# EAGLE design LK-1 (EAGLE 9.5.2)

## Sheet 1 of 2
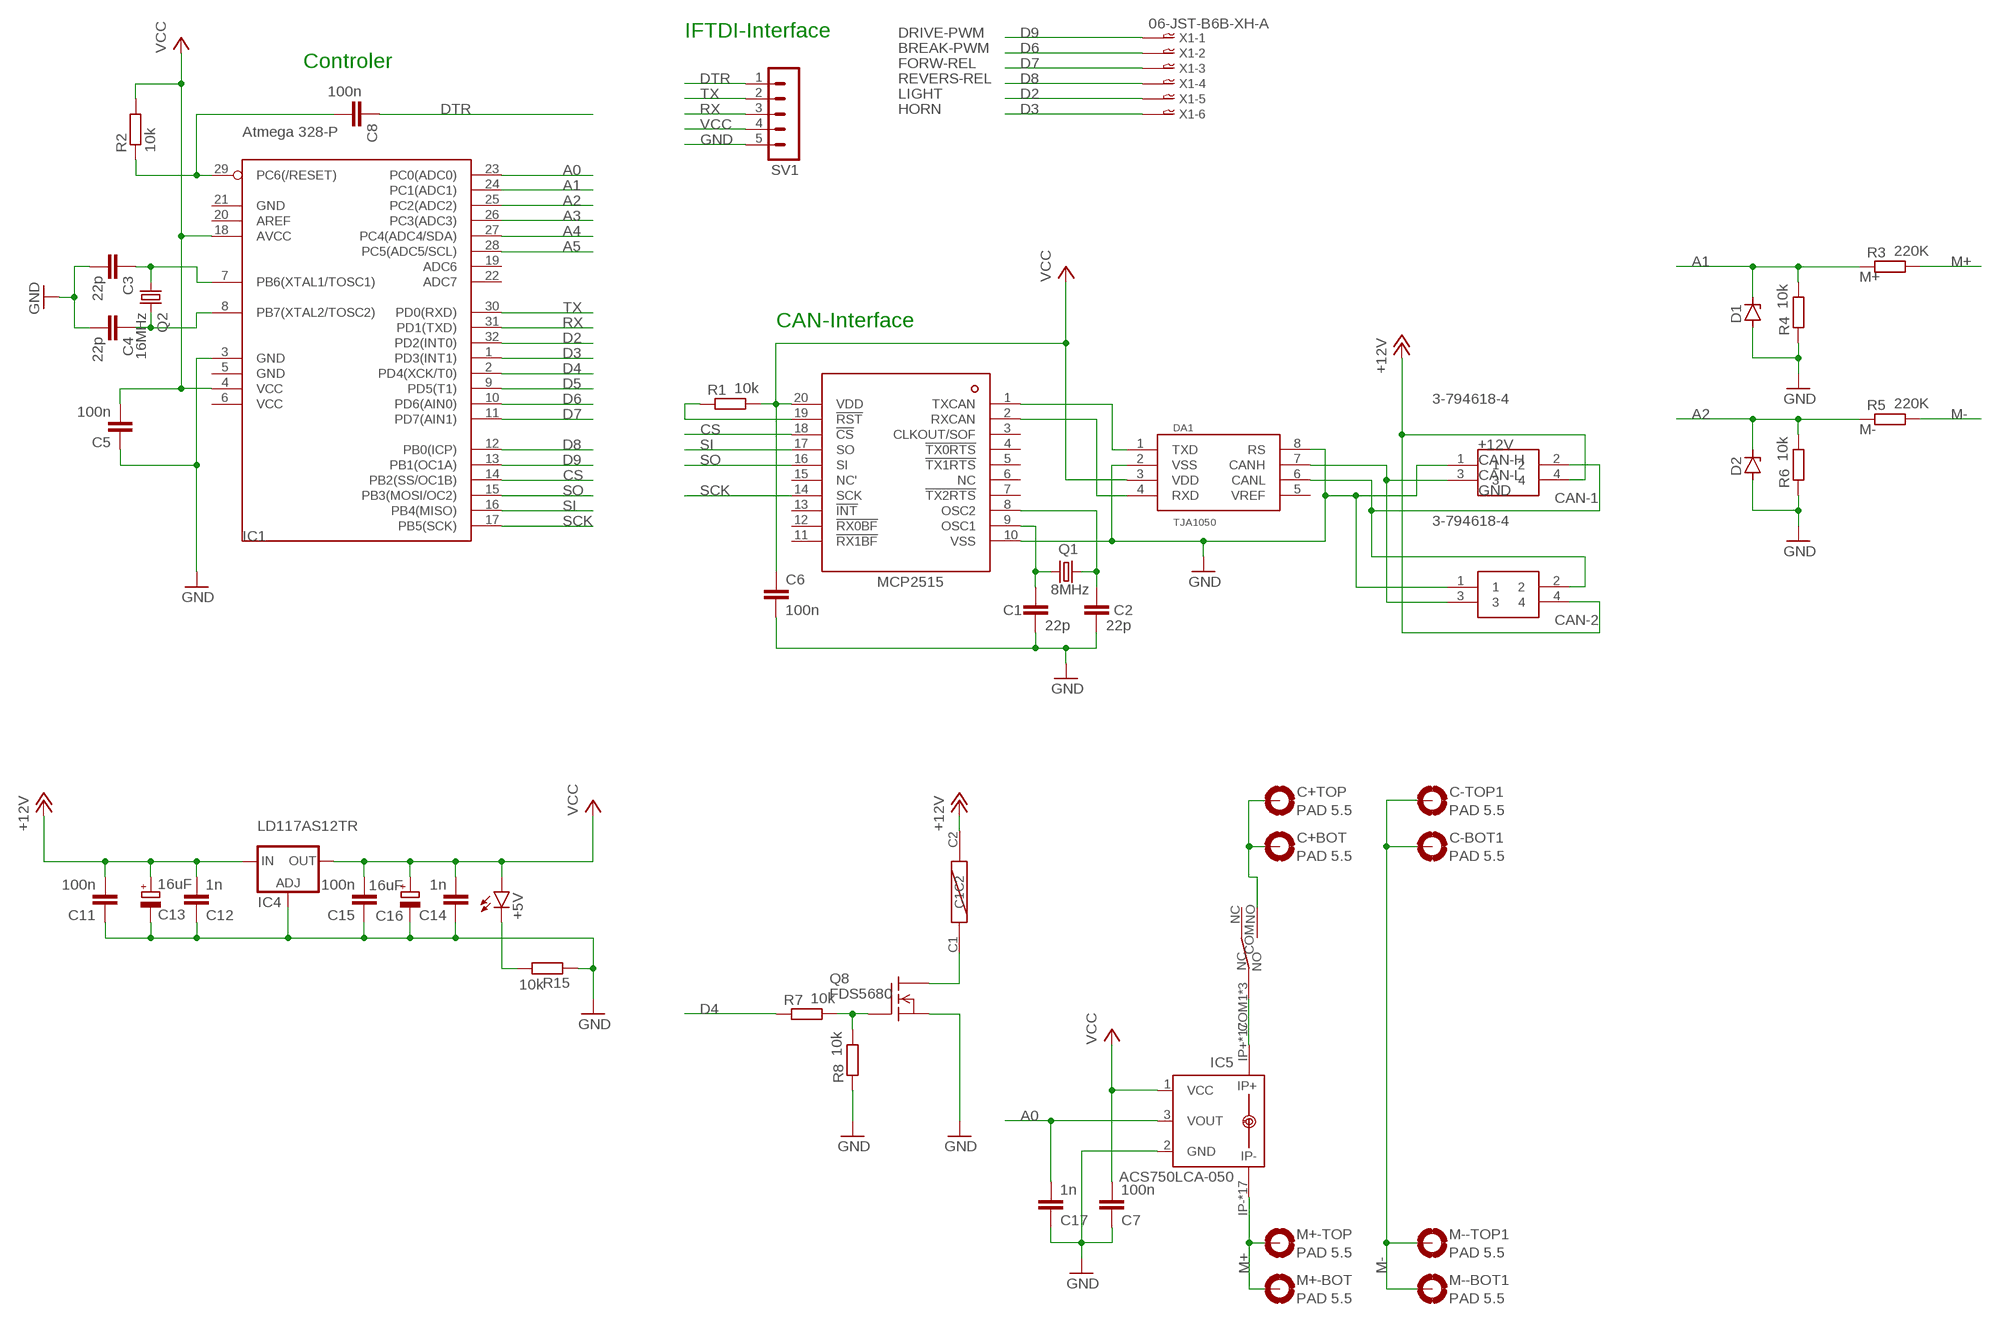
[diagram p0: schematic, sheet 1]

### Parts
+5V  LEDCHIP-LED0603  [CHIP-LED0603]
C1  22p  C-EUC0402K  [C0402K]
C2  22p  C-EUC0402K  [C0402K]
C3  22p  C-EUC0402K  [C0402K]
C4  22p  C-EUC0402K  [C0402K]
C5  100n  C-EUC0402K  [C0402K]
C6  100n  C-EUC0402K  [C0402K]
C7  100n  C-EUC0402K  [C0402K]
C8  100n  C-EUC0402K  [C0402K]
C11  100n  C-EUC0402K  [C0402K]
C12  1n  C-EUC0402K  [C0402K]
C13  16uF  CPOL-EUA/3216-18W  [A/3216-18W]
C14  1n  C-EUC0402K  [C0402K]
C15  100n  C-EUC0402K  [C0402K]
C16  16uF  CPOL-EUA/3216-18W  [A/3216-18W]
C17  1n  C-EUC0402K  [C0402K]
C+BOT  PAD 5.5  MOUNT-PAD-ROUND5.5  [5,5-PAD]
C+TOP  PAD 5.5  MOUNT-PAD-ROUND5.5  [5,5-PAD]
C-BOT1  PAD 5.5  MOUNT-PAD-ROUND5.5  [5,5-PAD]
C-TOP1  PAD 5.5  MOUNT-PAD-ROUND5.5  [5,5-PAD]
CAN-1  3-794618-4  [SHDRRA4W102P300_2X2_686X892X73]
CAN-2  3-794618-4  [SHDRRA4W102P300_2X2_686X892X73]
D1  ZENER-DIODESOD80C  [SOD80C]
D2  ZENER-DIODESOD80C  [SOD80C]
DA1  TJA1050  [SO08]
IC1  Atmega 328-P  MEGA8-AI  [TQFP32-08]
IC2  MCP2515  [TSSOP20]
IC4  LD117AS12TR  [SOT223]
IC5  ACS750LCA-050  [ACS75050]
M+-BOT  PAD 5.5  MOUNT-PAD-ROUND5.5  [5,5-PAD]
M+-TOP  PAD 5.5  MOUNT-PAD-ROUND5.5  [5,5-PAD]
M--BOT1  PAD 5.5  MOUNT-PAD-ROUND5.5  [5,5-PAD]
M--TOP1  PAD 5.5  MOUNT-PAD-ROUND5.5  [5,5-PAD]
Q1  8MHz  CRYSTALHC49S  [HC49/S]
Q2  16MHz  CRYSTALHC49S  [HC49/S]
Q8  FDS5680  [SO-8]
R1  10k  R-EU_R0805  [R0805]
R2  10k  R-EU_R0805  [R0805]
R3  220K  R-EU_R0805  [R0805]
R4  10k  R-EU_R0805  [R0805]
R5  220K  R-EU_R0805  [R0805]
R6  10k  R-EU_R0805  [R0805]
R7  10k  R-EU_R0805  [R0805]
R8  10k  R-EU_R0805  [R0805]
R15  10k  R-EU_R0805  [R0805]
SV1  MA05-1  [MA05-1]
U$1  FRA2C-2  [FRA2C-2]
X1  06-JST-B6B-XH-A  [B6B-XH]

### Nets
+12V: C11.2 C12.2 C13.+ CAN-1.4 CAN-2.4 IC4.3(IN) U$1.C2
A0: C17.2 IC1.23(PC0(ADC0)) IC5.3(VOUT)
A1: D1.C IC1.24(PC1(ADC1)) R3.1 R4.2
A2: D2.C IC1.25(PC2(ADC2)) R5.1 R6.2
A3: IC1.26(PC3(ADC3))
A4: IC1.27(PC4(ADC4/SDA))
A5: IC1.28(PC5(ADC5/SCL))
C-: C+BOT.B5,5(MOUNT) C+TOP.B5,5(MOUNT) U$1.NO
C-1: IC5.IP+ IC5.IP+@2(IP+) IC5.IP+@3(IP+) IC5.IP+@4(IP+) IC5.IP+@5(IP+) IC5.IP+@6(IP+) IC5.IP+@7(IP+) IC5.IP+@8(IP+) IC5.IP+@9(IP+) IC5.IP+@10(IP+) IC5.IP+@11(IP+) IC5.IP+@12(IP+) IC5.IP+@13(IP+) IC5.IP+@14(IP+) IC5.IP+@15(IP+) IC5.IP+@16(IP+) IC5.IP+@17(IP+) U$1.COM1(COM) U$1.COM2(COM) U$1.COM3(COM)
CAN-H: CAN-1.3 CAN-2.3 DA1.7(CANH)
CAN-L: CAN-1.2 CAN-2.2 DA1.6(CANL)
CAN-OCC1: C1.1 IC2.9(OSC1) Q1.1
CAN-OCC2: C2.1 IC2.8(OSC2) Q1.2
CS: IC1.14(PB2(SS/OC1B)) IC2.18(!CS)
D2: IC1.32(PD2(INT0)) X1.P$5
D3: IC1.1(PD3(INT1)) X1.P$6
D4: IC1.2(PD4(XCK/T0)) R7.1
D5: IC1.9(PD5(T1))
D6: IC1.10(PD6(AIN0)) X1.P$2
D7: IC1.11(PD7(AIN1)) X1.P$3
D8: IC1.12(PB0(ICP)) X1.P$4
D9: IC1.13(PB1(OC1A)) X1.P$1
DTR: C8.1 SV1.1
GND: C1.2 C2.2 C3.2 C4.2 C5.1 C6.2 C7.1 C11.1 C12.1 C13.- C14.1 C15.1 C16.- C17.1 CAN-1.1 CAN-2.1 D1.A D2.A DA1.2(VSS) DA1.8(RS) IC1.3(GND) IC2.10(VSS) IC4.1(ADJ) IC5.2(GND) Q8.1(S) Q8.2(S) Q8.3(S) R4.1 R6.1 R8.1 R15.1 SV1.5
M+: IC5.IP- IC5.IP-@2(IP-) IC5.IP-@3(IP-) IC5.IP-@4(IP-) IC5.IP-@5(IP-) IC5.IP-@6(IP-) IC5.IP-@7(IP-) IC5.IP-@8(IP-) IC5.IP-@9(IP-) IC5.IP-@10(IP-) IC5.IP-@11(IP-) IC5.IP-@12(IP-) IC5.IP-@13(IP-) IC5.IP-@14(IP-) IC5.IP-@15(IP-) IC5.IP-@16(IP-) IC5.IP-@17(IP-) M+-BOT.B5,5(MOUNT) M+-TOP.B5,5(MOUNT) R3.2
M-: C-BOT1.B5,5(MOUNT) C-TOP1.B5,5(MOUNT) M--BOT1.B5,5(MOUNT) M--TOP1.B5,5(MOUNT) R5.2
N$1: Q8.5(D) Q8.6(D) Q8.7(D) Q8.8(D) U$1.C1
N$2: Q8.4(G) R7.2 R8.2
N$6: IC2.19(!RST) R1.1
N$10: C3.1 IC1.7(PB6(XTAL1/TOSC1)) Q2.1
N$11: C4.1 IC1.8(PB7(XTAL2/TOSC2)) Q2.2
N$12: +5V.C R15.2
N$15: C8.2 IC1.29(PC6(/RESET)) R2.1
RX: IC1.31(PD1(TXD)) SV1.3
RXCAN: DA1.4(RXD) IC2.2(RXCAN)
SCK: IC1.17(PB5(SCK)) IC2.14(SCK)
SI: IC1.16(PB4(MISO)) IC2.17(SO)
SO: IC1.15(PB3(MOSI/OC2)) IC2.16(SI)
TX: IC1.30(PD0(RXD)) SV1.2
TXCAN: DA1.1(TXD) IC2.1(TXCAN)
VCC: +5V.A C5.2 C6.1 C7.2 C14.2 C15.2 C16.+ DA1.3(VDD) IC1.4(VCC) IC1.18(AVCC) IC2.20(VDD) IC4.4(OUT) IC5.1(VCC) R1.2 R2.2 SV1.4
Unconnected: DA1.5(VREF) IC1.19(ADC6) IC1.20(AREF) IC1.22(ADC7) IC2.3(CLKOUT/SOF) IC2.4(!TX0RTS) IC2.5(!TX1RTS) IC2.6(NC) IC2.7(!TX2RTS) IC2.11(!RX1BF) IC2.12(!RX0BF) IC2.13(!INT) IC2.15(NC') U$1.NC

### Notes on the sheet
- IFTDI-Interface | DRIVE-PWM
- BREAK-PWM
- Controler | FORW-REL
- REVERS-REL
- LIGHT
- HORN
- CAN-Interface

## Sheet 2 of 2

## Power pins joined to a net without a drawn wire
GND: IC1.5(GND) IC1.21(GND)
VCC: IC1.6(VCC)

## Library data of the parts
+5V = led:LED: LED OSRAM: - CHIPLED LG R971, LG N971, LY N971, LG Q971, LY Q971, LO R971, LY R971 LH N974, LH R974 LS Q976, LO Q976, LY Q976 LO Q996 - Hyper CHIPLED LW Q18S LB Q993, LB Q99A, LB R99A - SideLED LS A670, LO A670, LY A670, LG A670, LP A670 LB A673, LV A673, LT A673, LW A673 LH A674 LY A675 LS A676, LA A676, LO A676, LY A676, LW A676 LS A679, LY A679, LG A679 - Hyper Micro SIDELED® LS Y876, LA Y876, LO Y876, LY Y876 LT Y87S - SmartLED LW L88C, LW L88S LB L89C, LB L89S, LG L890 LS L89K, LO L89K, LY L89K LS L896, LA L896, LO L896, LY L896 - TOPLED LS T670, LO T670, LY T670, LG T670, LP T670 LSG T670, LSP T670, LSY T670, LOP T670, LYG T670 LG T671, LOG T671, LSG T671 LB T673, LV T673, LT T673, LW T673 LH T674 LS T676, LA T676, LO T676, LY T676, LB T676, LH T676, LSB T676, LW T676 LB T67C, LV T67C, LT T67C, LS T67K, LO T67K, LY T67K, LW E67C LS E67B, LA E67B, LO E67B, LY E67B, LB E67C, LV E67C, LT E67C LW T67C LS T679, LY T679, LG T679 LS T770, LO T770, LY T770, LG T770, LP T770 LB T773, LV T773, LT T773, LW T773 LH T774 LS E675, LA E675, LY E675, LS T675 LS T776, LA T776, LO T776, LY T776, LB T776 LHGB T686 LT T68C, LB T68C - Hyper Mini TOPLED® LB M676 - Mini TOPLED Santana® LG M470 LS M47K, LO M47K, LY M47K Source: http://www.osram.convergy.de LUXEON: - LUMILED® LXK2-PW12-R00, LXK2-PW12-S00, LXK2-PW14-U00, LXK2-PW14-V00 LXK2-PM12-R00, LXK2-PM12-S00, LXK2-PM14-U00 LXK2-PE12-Q00, LXK2-PE12-R00, LXK2-PE12-S00, LXK2-PE14-T00, LXK2-PE14-U00 LXK2-PB12-K00, LXK2-PB12-L00, LXK2-PB12-M00, LXK2-PB14-N00, LXK2-PB14-P00, LXK2-PB14-Q00 LXK2-PR12-L00, LXK2-PR12-M00, LXK2-PR14-Q00, LXK2-PR14-R00 LXK2-PD12-Q00, LXK2-PD12-R00, LXK2-PD12-S00 LXK2-PH12-R00, LXK2-PH12-S00 LXK2-PL12-P00, LXK2-PL12-Q00, LXK2-PL12-R00 Source: www.luxeon.com KINGBRIGHT: KA-3528ASYC Source: www.kingbright.com
C1-C8 C11 C12 C14 C15 C17 = rcl:C-EU: CAPACITOR, European symbol; SPICEPREFIX: C
C13 C16 = rcl:CPOL-EU: POLARIZED CAPACITOR, European symbol; SPICEPREFIX: C
C+BOT C+TOP C-BOT1 C-TOP1 M+-BOT M+-TOP M--BOT1 M--TOP1 = holes:MOUNT-PAD-ROUND: MOUNTING PAD, round
CAN-1 CAN-2 = SamacSys_Parts:3-794618-4: 4 way 2 row r/a header Mate-N-Lok Source: Datasheet <https://rs.componentsearchengine.com/Datasheets/2/3-794618-4.pdf>; DESCRIPTION: 4 way 2 row r/a header Mate-N-Lok; HEIGHT: 7.37mm; MANUFACTURER_NAME: TE Connectivity; MANUFACTURER_PART_NUMBER: 3-794618-4
D1 D2 = diode:ZENER-DIODE: Z-Diode
DA1 = TJA1050:TJA1050: High speed CAN transceiver Input levels compatible with 3.3 V and 5 V devices 5V supply
IC1 = atmel:MEGA8: MICROCONTROLLER 8 Kbytes FLASH, 1 kbytes SRAM, 512 bytes EEPROM, USART, 6-channel 10 bit ADC, 2-channel 8 bit ADC Pin compatible with Atmega48, ATMega88, ATMega168 Source: avr.lbr; MPN: ATMEGA8-16AU; OC_FARNELL: 9171371; OC_NEWARK: 73M8863
IC2 = mcp2514:MCP2515: Microchip Technology’s MCP2515 is a stand-alone Controller Area Network (CAN) controller that implements the CAN specification, version 2.0B. It is capable of transmitting and receiving both standard and extended data and remote frames. The MCP2515 has two acceptance masks and six acceptance filters that are used to filter out unwanted messages, thereby reducing the host MCUs overhead. The MCP2515 interfaces with microcontrollers (MCUs) via an industry standard Serial Peripheral Interface (SPI).
IC4 = v-reg:LD117A?*: Low drop fixed and adjustable positive voltage regulators 1 A Source: http://www.st.com/stonline/products/literature/ds/7194/ld1117axx.pdf
IC5 = allegro:ACS750*CA-050: Current Sensor display layer 49 Reference in BRD and place VIAs on circles Source: www.allegromicro.com/datafile/0750-050.pdf; MF: ALLEGRO MICROSYSTEMS, INC.; MPN: ACS750LCA-050; OC_FARNELL: 1457176; OC_NEWARK: 61H4464
Q1 Q2 = crystal:CRYSTAL: CRYSTAL; OC_FARNELL: 1667008; OC_NEWARK: unknown
Q8 = transistor-fet:FDS5680: 60V N-Channel PowerTrench TM MOSFET FAIRCHILD FDS5680.pdf
R1-R8 R15 = rcl:R-EU_: RESISTOR, European symbol; SPICEPREFIX: R
SV1 = con-lstb:MA05-1: PIN HEADER; OC_FARNELL: unknown; OC_NEWARK: unknown
U$1 = relais_auto:FRA2C-2
X1 = bt_con-jst-xh:06-JST: JST CONNECTOR

## Board
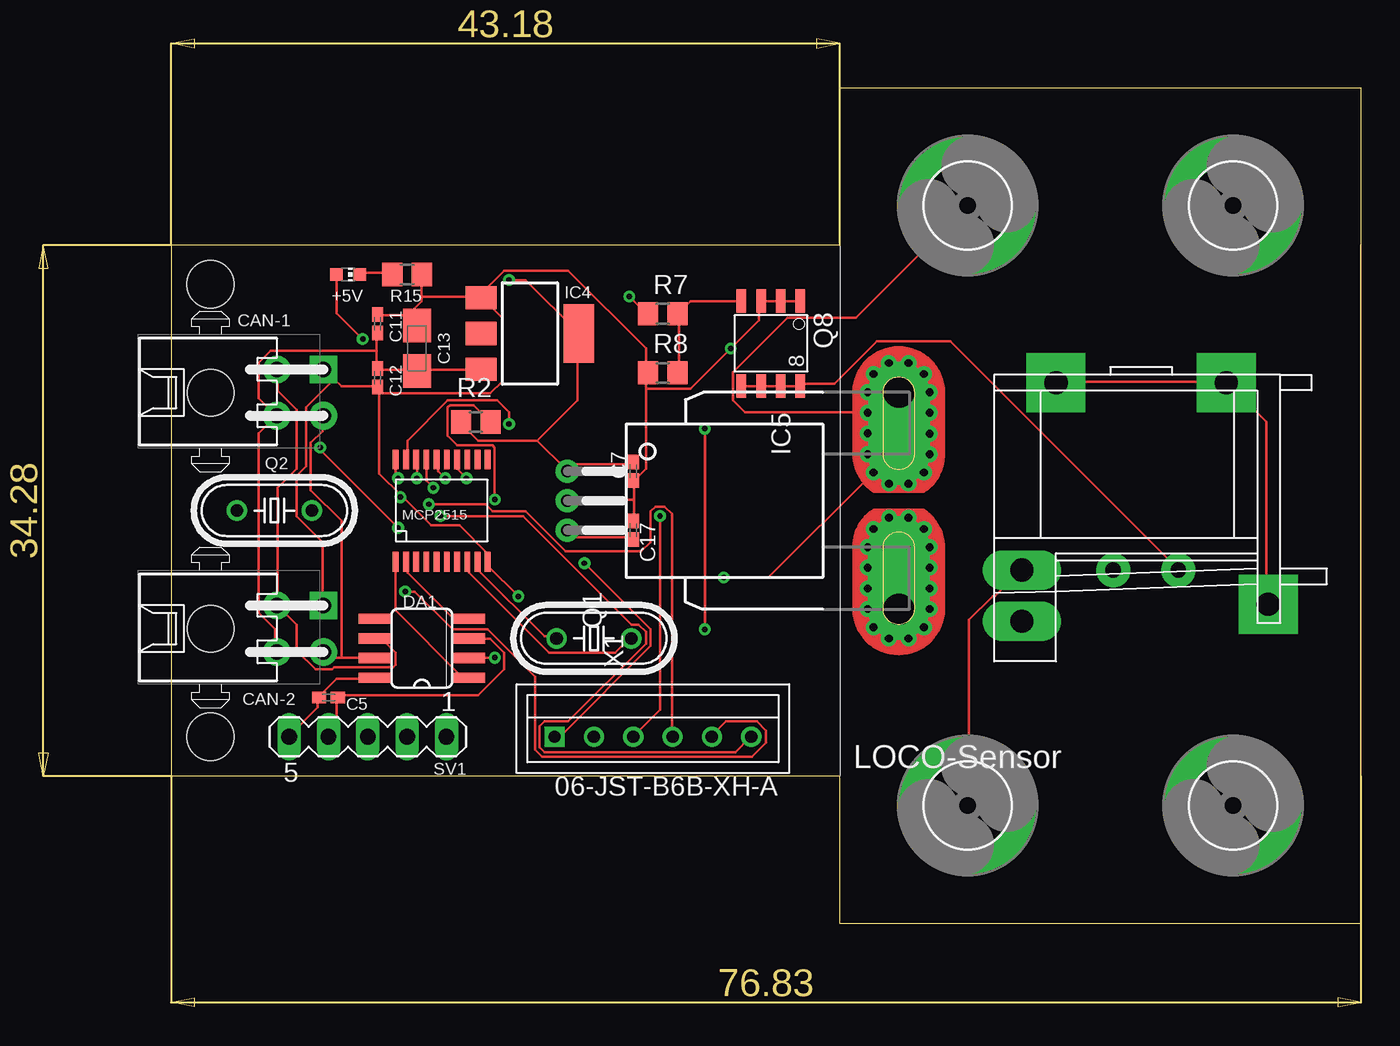
[diagram p1: board, top side]
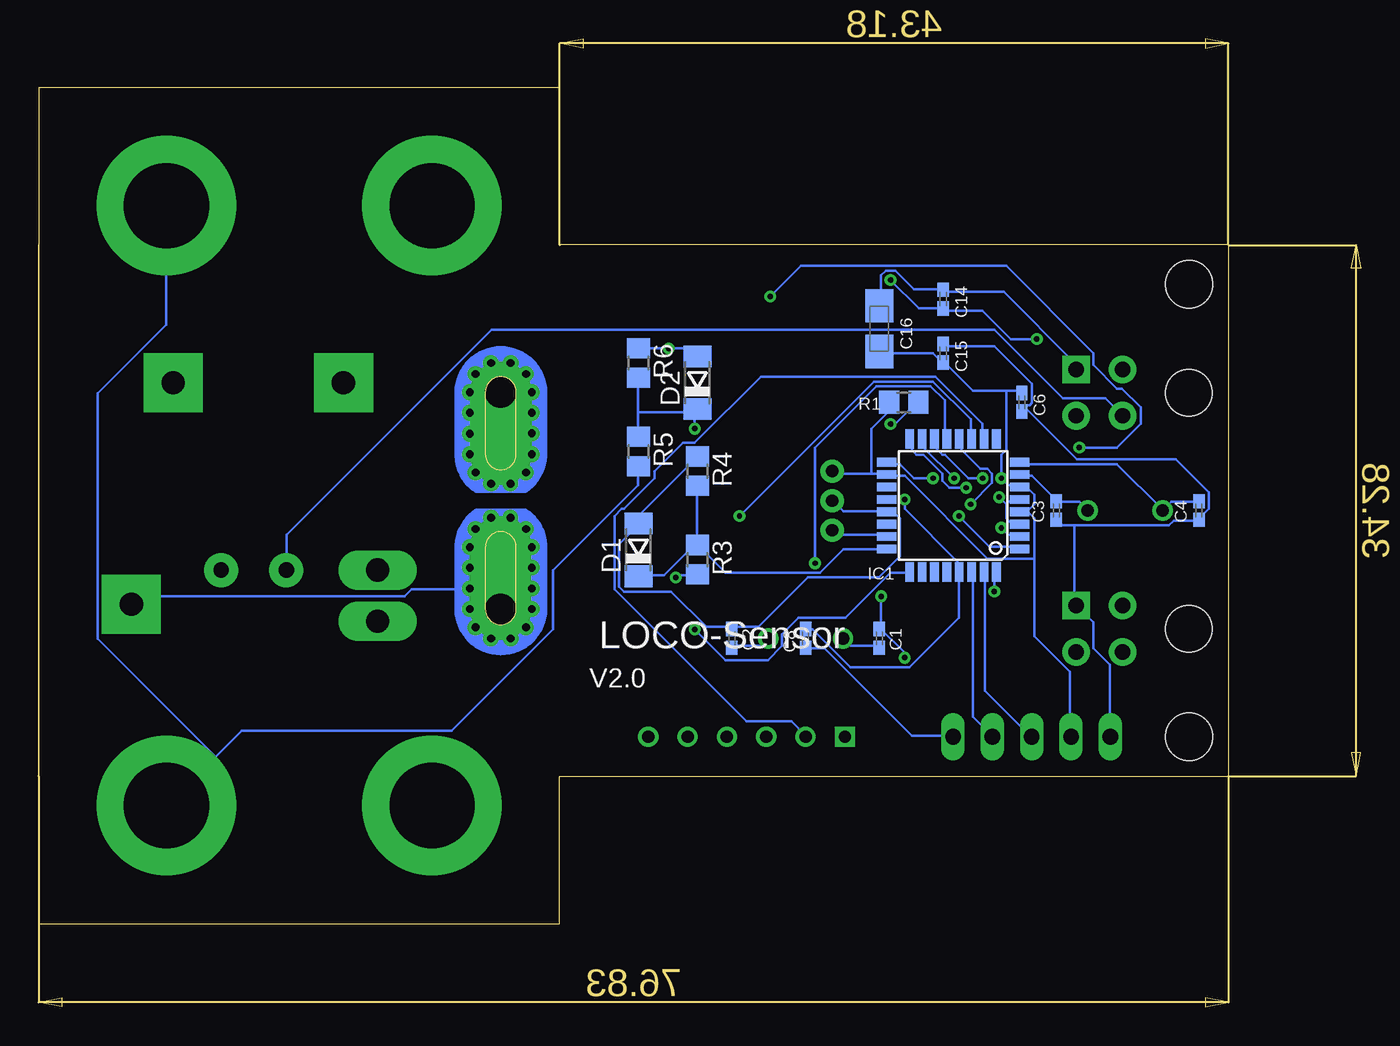
[diagram p2: board, bottom side, seen from below]

Size 76.83 x 53.98 mm. Coordinates in mm from the lower left corner, seen from the top.
Outline: 76.83,9.53 76.83,43.81
Outline: 0,43.81 0,9.53 43.18,9.53 43.18,0 76.83,0 76.83,53.98 43.18,53.98 43.18,43.81 0,43.81
Copper layers (1*16): Top 0.035mm / dielectric 1.5mm / Bottom 0.035mm
Design rules "default": minimum track width 6mil, minimum drill 0.35mm, track to track 6mil, track to pad 6mil, pad to pad 6mil, via to via 6mil, smd to smd 6mil, copper to edge 40mil, drill to drill 6mil, minimum pad ring 10mil, minimum via ring 8mil, stop-mask expansion 4mil, vias tented up to drill 0mil, thermal gap 10mil
Holes 3.05 mm at 2.54,12.07 2.54,41.28

### Footprints (pad centres in the part's own frame; a part is rotated, then mirrored left to right if it is on the bottom)
CHIP-LED0603 = smd 0.8 x 0.8: A 0,-0.75; C 0,0.75
C0402K = smd 0.925 x 0.74: 1 -0.6,0; 2 0.6,0
A/3216-18W = smd 2.15 x 1.8: + 1.475,0; - -1.475,0
5,5-PAD = drill 5.5 pad 9: B5,5 0,0
SHDRRA4W102P300_2X2_686X892X73 = drill 1 pad 1.778 square: 1 1.5,-7.3 | drill 1 pad 1.778: 2 1.5,-4.3; 3 -1.5,-7.3; 4 -1.5,-4.3 | hole 3: 0,0
SOD80C = smd 1.4 x 1.8: A 1.7,0; C -1.7,0
SO08 = smd 0.66 x 2.032: 1 -1.905,-3.073; 2 -0.635,-3.073; 3 0.635,-3.073; 4 1.905,-3.073; 5 1.905,3.073; 6 0.635,3.073; 7 -0.635,3.073; 8 -1.905,3.073
TQFP32-08 = smd 1.27 x 0.559: 1 -4.293,2.8; 2 -4.293,2; 3 -4.293,1.2; 4 -4.293,0.4; 5 -4.293,-0.4; 6 -4.293,-1.2; 7 -4.293,-2; 8 -4.293,-2.8; 17 4.293,-2.8; 18 4.293,-2; 19 4.293,-1.2; 20 4.293,-0.4; 21 4.293,0.4; 22 4.293,1.2; 23 4.293,2; 24 4.293,2.8 | smd 0.559 x 1.27: 9 -2.8,-4.293; 10 -2,-4.293; 11 -1.2,-4.293; 12 -0.4,-4.293; 13 0.4,-4.293; 14 1.2,-4.293; 15 2,-4.293; 16 2.8,-4.293; 25 2.8,4.293; 26 2,4.293; 27 1.2,4.293; 28 0.4,4.293; 29 -0.4,4.293; 30 -1.2,4.293; 31 -2,4.293; 32 -2.8,4.293
TSSOP20 = smd 1.27 x 0.381: 1 -3.302,2.642; 2 -3.302,1.981; 3 -3.302,1.321; 4 -3.302,0.66; 5 -3.302,0; 6 -3.302,-0.66; 7 -3.302,-1.321; 8 -3.302,-1.981; 9 -3.302,-2.642; 10 -3.302,-3.302; 11 3.302,-3.302; 12 3.302,-2.642; 13 3.302,-1.981; 14 3.302,-1.321; 15 3.302,-0.66; 16 3.302,0; 17 3.302,0.66; 18 3.302,1.321; 19 3.302,1.981; 20 3.302,2.642
SOT223 = smd 1.5 x 2: 1 -2.3,-3.15; 2 0,-3.15; 3 2.3,-3.15 | smd 3.8 x 2: 4 0,3.15
ACS75050 = drill 0.8 pad 1.5: 1 -1.91,-21.4; 2 0,-21.4; 3 1.91,-21.4 | drill 2 pad 4 offset: IP+ 7,0; IP- -7,0 | drill 0.5 pad 0.9: IP+@2 8.89,-0.635; IP+@3 8.89,0.635; IP+@4 8.175,1.625; IP+@5 7,2; IP+@6 5.675,2; IP+@7 4.325,2; IP+@8 3,2; IP+@9 1.825,1.625; IP+@10 1.1,0.625; IP+@11 1.1,-0.625; IP+@12 1.825,-1.625; IP+@13 3,-2; IP+@14 4.325,-2; IP+@15 5.675,-2; IP+@16 7,-2; IP+@17 8.175,-1.625; IP-@2 -8.89,-0.635; IP-@3 -8.89,0.635; IP-@4 -8.175,1.625; IP-@5 -7,2; IP-@6 -5.675,2; IP-@7 -4.325,2; IP-@8 -3,2; IP-@9 -1.825,1.625; IP-@10 -1.1,0.625; IP-@11 -1.1,-0.625; IP-@12 -1.825,-1.625; IP-@13 -3,-2; IP-@14 -4.35,-2; IP-@15 -5.675,-2; IP-@16 -7,-2; IP-@17 -8.175,-1.625
HC49/S = drill 0.813: 1 -2.413,0; 2 2.413,0
SO-8 = smd 1.524 x 0.61: 1 -2.743,1.905; 2 -2.743,0.635; 3 -2.743,-0.635; 4 -2.743,-1.905; 5 2.743,-1.905; 6 2.743,-0.635; 7 2.743,0.635; 8 2.743,1.905
R0805 = smd 1.3 x 1.5: 1 -0.95,0; 2 0.95,0
MA05-1 = drill 1.016 long: 1 -5.08,0; 2 -2.54,0; 3 0,0; 4 2.54,0; 5 5.08,0
FRA2C-2 = drill 1 pad 2.184: C1 -7.9,12.1; C2 -3.7,12.1 | drill 1.5 pad 3.81 square: COM1 0,0; COM2 -11,0; COM3 -13.7,14.3 | drill 1.5 pad 2.54 long: NC 2.2,15.4; NO 2.2,12.1
B6B-XH = drill 0.8 square: P$1 -6.35,0 | drill 0.8: P$2 -3.81,0; P$3 -1.27,0; P$4 1.27,0; P$5 3.81,0; P$6 6.35,0

### Placement (x,y rotation side)
+5V  11.43,41.91 270 top
C1  22.54,18.42 90 bottom
C2  32.07,18.42 90 bottom
C3  11.11,26.67 270 bottom
C4  1.91,26.67 270 bottom
C5  10.16,14.61 0 top
C6  13.34,33.66 270 bottom
C7  29.85,29.21 90 top
C8  27.3,18.42 90 bottom
C11  13.34,38.73 270 top
C12  13.34,35.24 90 top
C13  15.88,37.15 270 top
C14  18.42,40.32 270 bottom
C15  18.42,36.83 270 bottom
C16  22.54,38.42 270 bottom
C17  29.85,25.4 270 top
C+BOT  51.44,7.62 0 top
C+TOP  51.44,7.62 0 top
C-BOT1  68.58,46.36 0 top
C-TOP1  68.58,46.36 0 top
CAN-1  2.54,34.29 90 top
CAN-2  2.54,19.05 90 top
D1  38.1,24.13 90 bottom
D2  34.29,34.92 90 bottom
DA1  16.19,17.78 90 top
IC1  17.78,26.99 180 bottom
IC2  17.14,26.67 90 top
IC4  23.18,38.1 270 top
IC5  46.99,27.31 270 top
M+-BOT  51.44,46.36 0 top
M+-TOP  51.44,46.36 0 top
M--BOT1  68.58,7.62 0 top
M--TOP1  68.58,7.62 0 top
Q1  27.3,18.42 0 top
Q2  6.67,26.67 180 top
Q8  38.73,37.47 270 top
R1  20.96,33.66 180 bottom
R2  19.68,32.39 180 top
R3  34.29,23.5 270 bottom
R4  34.29,29.21 270 bottom
R5  38.1,30.48 270 bottom
R6  38.1,36.2 270 bottom
R7  31.75,39.37 0 top
R8  31.75,35.56 0 top
R15  15.24,41.91 180 top
SV1  12.7,12.07 180 top
U$1  57.15,34.92 180 top
X1  31.11,12.07 0 top

### Tracks (layer width: path | path; a pad name or v marks a point on that pad's centre or on a via)
+12V
  Top 0.152: 13.28,36.98 13.28,38.05 C11.2 | 13.28,36.98 13.28,35.92 C12.2 13.44,35.76 15.88,35.76 | 15.88,35.76 19.99,35.76 IC4.3 | 15.88,35.76 C13.+ | CAN-2.4 6.73,17.63 6.73,19 5.66,20.07 5.66,31.65 6.73,32.72 CAN-1.4 6.73,32.87 5.66,33.93 5.66,36.22 6.43,36.98 13.28,36.98
  Bottom 0.152: U$1.C2 60.83,22.96 60.83,25.1 47.57,38.35 15.11,38.35 10.69,33.93 7.95,33.93 6.88,32.87 CAN-1.4
A0
  Top 0.152: C17.2 29.74,24.94 25.93,24.94 25.63,25.25 IC5.3
  Bottom 0.152: IC1.23 22.12,25.1 25.32,25.1 25.48,25.25 IC5.3
A1
  Bottom 0.152: IC1.24 22.12,24.18 24.87,24.18 26.39,22.66 32.49,22.66 34.16,24.33 R3.1 | 34.31,24.64 34.31,24.49 R3.1 | 34.31,24.64 34.31,28.14 R4.2 | 34.31,24.64 36.45,22.5 37.97,22.5 D1.C | 34.31,24.64 R3.1
A2  (via drill 0.35)
  Top 0.152: v34.47,31.95 v34.47,19
  Bottom 0.152: 38.12,33.02 38.12,35.15 R6.2 | 38.12,33.02 38.12,31.5 R5.1 | v34.47,19 32.49,17.02 29.74,17.02 28.83,17.93 28.83,18.69 27.76,19.76 24.71,19.76 21.82,22.66 20.6,22.66 IC1.25 | 34.47,33.02 v34.47,31.95 | 34.47,33.02 34.31,33.17 D2.C 34.47,33.02 | 34.47,33.02 38.12,33.02
C-
  Top 0.152: U$1.NO 54.89,22.81 53.21,21.13 53.06,21.13 51.54,19.61 51.54,7.72 C+TOP.B5,5 51.38,7.72
C-1
  Top 0.152: U$1.COM3 70.74,20.68 70.74,32.41 68.3,34.85 U$1.COM2 68.15,35 57.17,35 U$1.COM1
  Bottom 0.152: IC5.IP+@6 49.1,21.59 52.76,21.59 53.21,21.13 70.28,21.13 70.74,20.68 U$1.COM3
CAN-H
  Top 0.152: 11,17.17 10.24,17.17 9.93,17.47 CAN-2.3 | 11,17.17 12.98,17.17 DA1.7 | 11,17.17 11,26.01 9.02,27.99 9.02,31.04 9.78,31.8 9.78,32.72 CAN-1.3
CAN-L
  Top 0.152: DA1.6 13.13,18.39 13.59,18.39 14.5,17.47 14.5,16.71 14.35,16.56 10.54,16.56 10.39,16.41 9.32,16.41 8.1,17.63 8.1,19.3 6.88,20.52 CAN-2.2 6.88,20.68 6.88,28.14 8.1,29.36 8.1,33.17 6.88,34.39 6.88,35.76 CAN-1.2
CAN-OCC1
  Top 0.152: IC2.9 19.84,23.27 19.84,22.81 24.11,18.54 24.87,18.54 Q1.1
  Bottom 0.152: Q1.1 24.41,17.93 22.58,17.93 C1.1
CAN-OCC2
  Top 0.152: IC2.8 19.23,23.27 19.23,22.66 24.41,17.47 28.68,17.47 29.59,18.39 Q1.2
  Bottom 0.152: Q1.2 30.2,17.93 32.03,17.93 C2.1
CS  (via drill 0.35)
  Top 0.152: v15.88,28.75 15.88,29.97 IC2.18
  Bottom 0.152: v15.88,28.75 16.79,28.75 18.31,30.28 18.47,30.28 18.92,30.73 18.92,31.19 IC1.14
D2  (via drill 0.35)
  Top 0.152: v15.11,21.44 15.72,21.44 18.16,19 20.45,19 23.5,15.95 23.5,11.23 23.95,10.77 37.52,10.77 38.43,11.68 38.43,12.45 37.82,13.06 35.84,13.06 34.92,12.14 X1.P$5
  Bottom 0.152: v15.11,21.44 15.11,22.66 IC1.32
D3  (via drill 0.35)
  Top 0.152: v17.4,26.31 22.73,26.31 29.74,19.3 30.2,19.3 30.66,18.85 30.66,18.09 25.63,13.06 24.11,13.06 23.8,12.75 23.8,11.38 24.11,11.07 36.45,11.07 37.36,11.99 X1.P$6
  Bottom 0.152: v17.4,26.31 15.42,24.33 13.59,24.33 IC1.1
D4  (via drill 0.35)
  Top 0.152: v14.66,25.55 9.63,30.58 v9.63,30.73 | v29.59,40.49 30.66,39.42 R7.1
  Bottom 0.152: v14.66,25.55 14.2,25.1 13.59,25.1 IC1.2 | v9.63,30.73 7.19,30.73 5.66,32.26 5.66,33.33 6.88,34.54 7.19,34.54 8.71,36.07 8.71,36.83 14.35,42.47 27.61,42.47 v29.59,40.49
D6
  Bottom 0.152: IC1.10 15.88,31.34 15.88,32.26 18.92,35.31 30.2,35.31 34.47,31.04 35.23,31.04 37.06,29.21 37.06,28.75 39.04,26.77 39.19,26.77 39.65,26.31 39.65,21.59 31.11,13.06 28.22,13.06 27.3,12.14 X1.P$2
D7  (via drill 0.35)
  Top 0.152: v31.57,26.31 31.57,13.82 29.9,12.14 X1.P$3
  Bottom 0.152: v31.57,26.31 22.89,35 19.07,35 16.64,32.56 16.64,31.34 IC1.11
D8  (via drill 0.35)
  Top 0.152: v16.64,27.08 20.29,27.08 20.75,26.62 22.89,26.62 25.48,24.03 30.35,24.03 30.96,24.64 30.96,26.62 31.27,26.92 31.88,26.92 32.33,26.47 32.33,12.14 X1.P$4
  Bottom 0.152: v16.64,27.08 15.27,28.45 15.27,29.06 15.57,29.36 16.03,29.36 17.25,30.58 17.25,31.19 IC1.12
D9  (via drill 0.35)
  Top 0.152: v26.69,23.27 30.96,19 30.96,17.93 25.17,12.14 24.87,12.14 X1.P$1
  Bottom 0.152: v26.69,23.27 26.69,30.73 22.73,34.7 19.23,34.7 18.31,33.78 18.31,31.34 IC1.13
DTR
  Bottom 0.152: C8.1 27.3,17.78 26.09,17.78 20.45,12.14 17.86,12.14 SV1.1
GND  (via drill 0.35)
  Top 0.152: SV1.5 7.64,12.14 9.47,13.97 9.47,14.58 C5.1 9.63,14.73 10.69,15.8 12.98,15.8 DA1.8 | Q8.1 40.56,40.18 39.5,40.18 Q8.2 39.34,40.18 38.12,40.18 Q8.3 37.97,40.18 37.97,38.96 v36.14,37.14 33.55,34.54 30.66,34.54 | 29.9,28.6 29.9,27.38 | 29.9,27.38 29.9,26.01 C17.1 | 30.66,34.54 30.66,29.36 29.9,28.6 | 30.66,34.54 30.66,35.46 R8.1 30.66,35.61 30.66,37.14 25.63,42.16 21.51,42.16 19.84,40.49 | 29.9,28.6 C7.1 | 29.9,27.38 25.63,27.38 IC5.2 | 15.27,39.27 13.44,39.27 C11.1 | 15.27,39.27 15.88,38.66 C13.- 15.27,39.27 | 16.18,40.49 16.18,40.18 15.27,39.27 | 16.18,40.49 16.18,41.86 R15.1 | 16.18,40.49 19.84,40.49 | 19.84,40.49 19.99,40.49 IC4.1 | v20.9,17.17 19.38,17.17 DA1.2 | 10.54,35.15 9.93,35.76 CAN-1.1 10.54,35.15 | 10.54,35.15 11,34.7 13.28,34.7 C12.1 | 14.81,27.69 13.44,29.06 13.44,34.24 | 14.81,27.69 16.79,25.71 18.62,25.71 20.45,23.88 IC2.10 20.45,23.11 v22.43,21.13 | 13.44,34.24 13.44,34.54 C12.1 | 14.81,27.69 v14.81,27.53 | 13.44,34.24 20.6,34.24 21.36,35 21.36,39.12 20.14,40.34 IC4.1 | 13.44,34.24 C12.1 | 19.84,40.49 IC4.1 | 10.54,35.15 8.71,33.33 8.71,29.52 8.1,28.9 8.1,26.31 9.78,24.64 9.78,20.68 CAN-2.1
  Bottom 0.152: 13.13,33.33 12.98,33.48 12.83,33.48 12.68,33.63 12.68,34.85 15.11,37.29 18.31,37.29 C15.1 | 13.13,33.33 13.28,33.17 C6.2 13.13,33.33 | 9.93,25.71 10.69,25.71 11,26.01 C3.2 | 9.93,25.71 3.84,25.71 3.53,26.01 2.01,26.01 C4.2 1.85,26.16 1.24,26.77 1.24,27.84 3.38,29.97 9.78,29.97 13.13,33.33 | 9.93,25.71 9.93,20.68 CAN-2.1 9.78,20.52 8.71,19.46 8.71,17.78 7.64,16.71 7.64,12.14 SV1.5 | R4.1 34.31,30.12 37.97,26.47 37.97,25.86 D1.A 38.12,25.71 39.34,24.49 39.34,21.74 39.04,21.44 35.99,21.44 33.71,19.15 32.18,19.15 C2.2 32.03,19.15 30.35,19.15 27.15,22.35 22.58,22.35 21.21,23.72 21.21,26.16 21.51,26.47 21.97,26.47 IC1.21 22.12,26.62 24.87,26.62 25.48,27.23 IC5.2 | R6.1 37.97,37.14 v36.14,37.14 34.77,37.14 34.31,36.68 D2.A | C16.- 22.43,40.03 22.43,41.86 22.12,42.16 21.51,42.16 20.29,40.95 18.47,40.95 C14.1 18.31,40.79 14.5,40.79 9.93,36.22 9.93,35.92 CAN-1.1 | v20.9,17.17 20.9,17.47 22.43,19 C1.2 22.43,19.15 v22.43,21.13 | 14.35,27.08 14.35,26.16 14.05,25.86 13.59,25.86 IC1.3 | 14.35,27.08 14.05,27.38 13.59,27.38 IC1.5 | v14.81,27.53 14.35,27.08
M+  (via drill 0.35)
  Top 0.152: v35.69,22.35 38.58,22.35 45.29,29.06 IC5.IP-@12 | IC5.IP-@15 44.98,33.02 37.06,33.02 36.3,33.78 36.3,35.61 39.8,39.12 44.22,39.12 51.38,46.28 M+-BOT.B5,5 51.38,46.43
  Bottom 0.152: v35.69,22.35 35.53,22.5 34.31,22.5 R3.2
M-
  Top 0.152: 68.6,46.43 C-TOP1.B5,5 | 68.6,7.72 M--BOT1.B5,5
  Bottom 0.152: 65.41,10.77 68.45,7.72 M--BOT1.B5,5 65.41,10.77 | 65.41,10.77 63.73,12.45 50.16,12.45 43.61,19 43.61,22.81 38.12,28.3 38.12,29.52 R5.2 | 65.41,10.77 73.02,18.39 73.02,34.24 68.6,38.66 68.6,46.28 C-TOP1.B5,5
N$1
  Top 0.152: Q8.5 36.91,34.7 37.97,34.7 Q8.6 38.12,34.7 39.34,34.7 Q8.7 39.5,34.7 40.56,34.7 Q8.8 40.72,34.85 42.85,34.85 45.59,37.59 50.32,37.59 64.95,22.96 U$1.C1
N$2
  Top 0.152: R8.2 32.79,35.61 32.79,39.27 R7.2 32.79,39.42 33.55,40.18 36.75,40.18 Q8.4
N$6  (via drill 0.35)
  Top 0.152: v21.82,32.26 21.82,33.02 21.06,33.78 17.86,33.78 15.27,31.19 15.27,29.97 IC2.19
  Bottom 0.152: v21.82,32.26 21.51,32.26 20.14,33.63 R1.1
N$10
  Bottom 0.152: Q2.1 9.17,26.77 9.63,27.23 11,27.23 C3.1 11.15,27.38 12.68,28.9 13.44,28.9 IC1.7
N$11
  Bottom 0.152: C4.1 2.01,27.23 3.68,27.23 4.14,26.77 Q2.2 4.29,26.77 7.19,29.67 13.44,29.67 IC1.8
N$12
  Top 0.152: +5V.C 12.22,42.01 14.2,42.01 R15.2
N$15  (via drill 0.35)
  Top 0.152: v20.9,27.38 20.9,30.73 20.75,30.89 18.47,30.89 17.86,31.5 17.86,33.33 18.01,33.48 19.53,33.48 20.6,32.41 R2.1
  Bottom 0.152: C8.2 27.3,19 26.85,19 24.41,16.56 20.6,16.56 17.4,19.76 17.4,22.66 IC1.29 17.4,22.81 17.4,23.27 20.9,26.77 v20.9,27.38
RX
  Bottom 0.152: IC1.31 15.72,22.66 15.72,15.04 12.83,12.14 SV1.3
RXCAN
  Top 0.152: IC2.2 15.27,23.27 15.27,22.66 18.16,19.76 19.23,19.76 DA1.4
SCK  (via drill 0.35)
  Top 0.152: IC2.14 18.47,29.36 v19.07,28.75
  Bottom 0.152: v19.07,28.75 20.29,28.75 21.21,29.67 21.97,29.67 IC1.17
SI  (via drill 0.35)
  Top 0.152: IC2.17 16.48,28.6 v16.94,28.14
  Bottom 0.152: v16.94,28.14 18.01,28.14 18.47,28.6 18.47,29.06 19.68,30.28 20.14,30.28 20.45,30.58 20.45,31.19 IC1.16
SO  (via drill 0.35)
  Top 0.152: v17.7,28.75 17.25,29.21 17.25,29.97 IC2.16
  Bottom 0.152: v17.7,28.75 19.68,30.73 19.68,31.19 IC1.15
TX
  Bottom 0.152: IC1.30 16.48,22.66 16.48,13.36 15.27,12.14 SV1.2
TXCAN
  Top 0.152: IC2.1 14.5,20.22 18.77,15.95 19.23,15.95 DA1.1
VCC  (via drill 0.35)
  Top 0.152: v12.37,37.74 10.69,39.42 10.69,41.86 +5V.A | C7.2 29.74,29.67 25.93,29.67 25.63,29.36 IC5.1 25.48,29.36 23.65,31.19 | 23.65,31.19 19.84,31.19 18.77,32.26 R2.2 | 23.65,31.19 26.24,33.78 26.24,38.05 IC4.4 26.24,38.2 22.89,41.55 v21.82,41.55 | SV1.4 10.69,12.6 10.69,14.58 C5.2 10.85,14.73 19.84,14.73 21.51,16.41 21.51,17.47 20.6,18.39 19.38,18.39 DA1.3 | IC2.20 14.5,28.9 v14.66,28.75
  Bottom 0.152: v12.37,37.74 14.05,37.74 15.88,39.57 18.31,39.57 C14.2 18.47,39.73 19.99,39.73 v21.82,41.55 | 23.04,29.06 25.32,29.06 25.48,29.21 IC5.1 | 23.04,29.06 22.12,29.06 IC1.18 21.97,28.9 20.9,28.9 15.57,23.57 12.52,23.57 | 23.04,29.06 23.04,31.95 21.97,33.02 21.97,33.63 R1.2 | 12.98,26.62 13.44,26.62 IC1.4 12.98,26.62 | 12.98,26.62 12.52,27.08 12.52,27.69 12.98,28.14 13.44,28.14 IC1.6 13.59,28.3 14.2,28.3 v14.66,28.75 14.66,30.28 14.35,30.58 14.35,34.39 | 14.35,34.39 16.48,34.39 18.31,36.22 C15.2 18.47,36.22 19.07,36.83 22.43,36.83 C16.+ | 14.35,34.39 13.44,34.39 C6.1 | 12.52,23.57 12.52,26.16 12.98,26.62 | 12.52,23.57 12.52,18.54 10.24,16.26 10.24,12.14 SV1.4

### Text on the board
tNames: LOCO-Sensor
bNames: LOCO-Sensor | V2.0